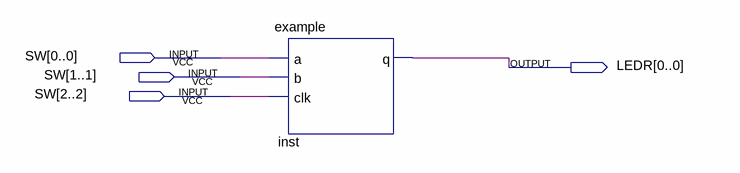
[diagram p0: schematic sheet]
// Quartus schematic dff_nand.bdf as structural Verilog: 1 symbols, 4 pins
module dff_nand (
  input  [2:0] SW,
  output [0:0] LEDR
);

  example inst (.a(SW[0]), .b(SW[1]), .clk(SW[2]), .q(LEDR[0]));
endmodule
